# Altium project LightBarrier.PrjPcb
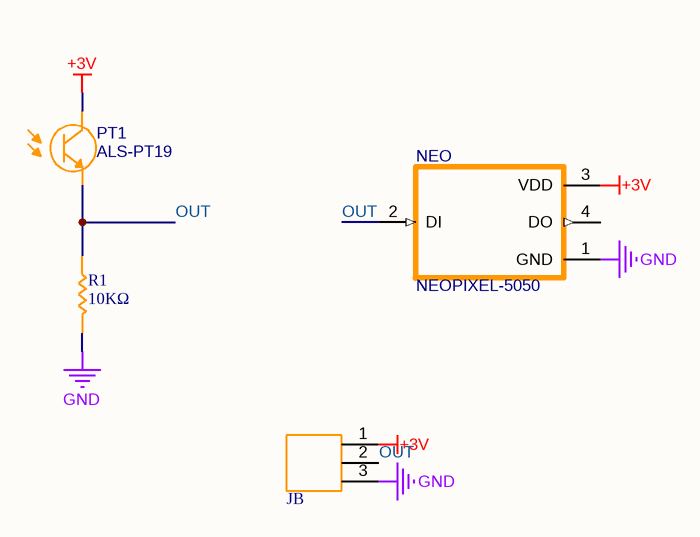
[diagram p0: LightBarrier.SchDoc]
1 sheet, 4 parts. Net scope: global (net labels, ports and power ports of the same name join across sheets).
Board file: LightBarrier.PcbDoc

## Sheet LightBarrier.SchDoc
size A; SheetNumber: 1; SheetTotal: 1

### Parts
JB  3PIN  [3PIN]  (value not drawn)
NEO  NEOPIXEL-5050  [NEOPIXEL-5050]
PT1  ALS-PT19  [ALS-PT19]
R1  10KΩ  [RES_0603]

### Nets
+3V: JB.1 NEO.3(VDD) PT1.C
GND: JB.3 NEO.1(GND) R1.1
OUT: JB.2 NEO.2(DI) PT1.E R1.2

Not connected (* = marked no-connect by the designer): NEO 4(DO)

### Library data of the parts
JB = 3PIN: 2.54 Header
R1 = RES_0603: Resistor SMD 0603 generic